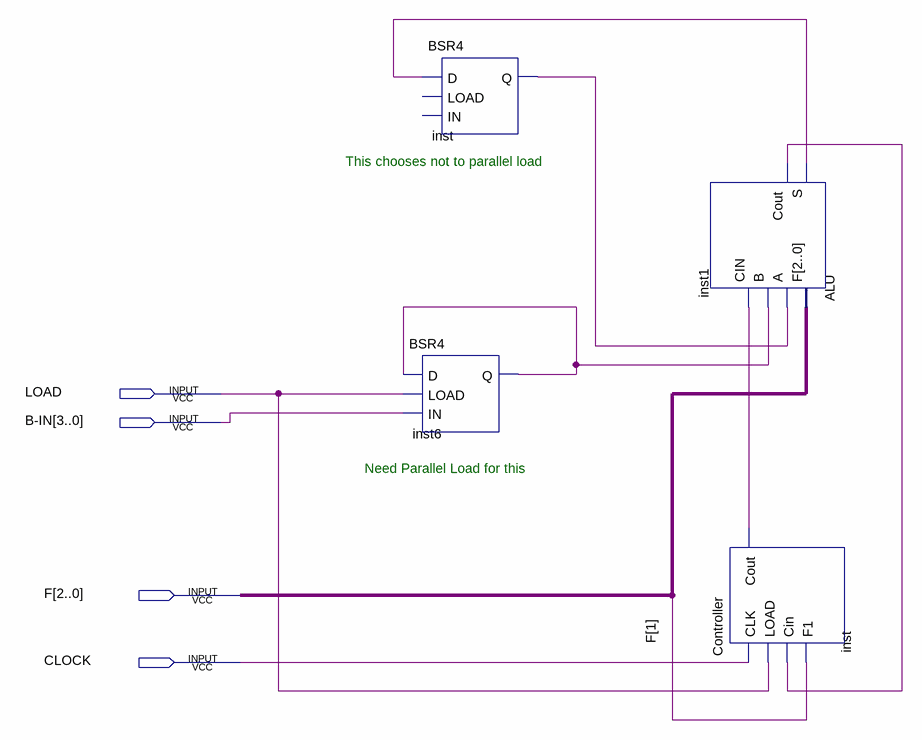
[diagram p0: schematic sheet]
// Quartus schematic Project2.bdf as structural Verilog: 4 symbols, 4 pins
module Project2 (
  input  LOAD,
  input  [3:0] \B-IN ,
  input  [2:0] F,
  input  CLOCK
);

  wire inst1_cout, inst1_s, inst6_q, inst_cout, inst_q, undriven;

  BSR4 inst (.D(inst1_s), .Q(inst_q));  // open: LOAD, IN
  BSR4 inst6 (.D(inst6_q), .LOAD(LOAD), .IN(undriven), .Q(inst6_q));
  ALU inst1 (.F(F), .A(inst_q), .B(inst6_q), .CIN(inst_cout), .S(inst1_s), .Cout(inst1_cout));
  Controller inst_dup2 (.CLK(CLOCK), .LOAD(LOAD), .Cin(inst1_cout), .F1(F[1]), .Cout(inst_cout));

  // Notes on the sheet:
  //   This chooses not to parallel load
  //   Need Parallel Load for this
endmodule
